# EAGLE schematic control master (EAGLE 8.4.3)
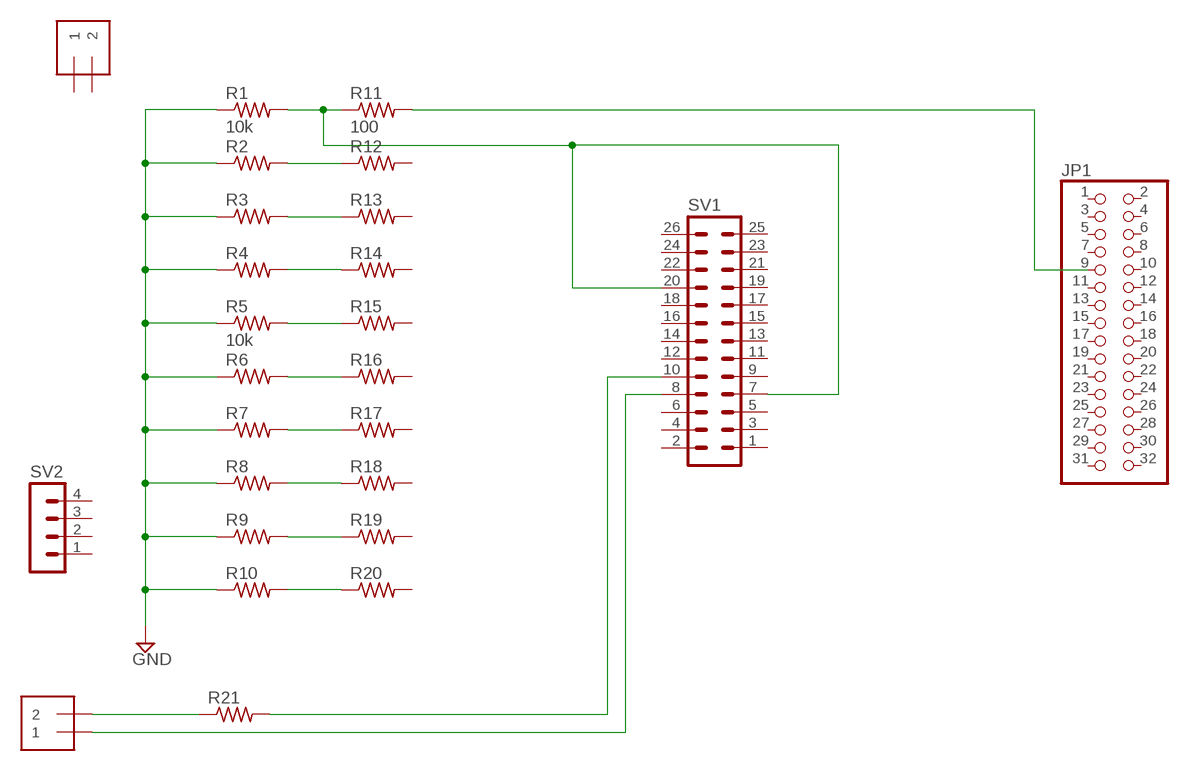
[diagram p0: schematic, sheet 1]

## Parts
J1  1X2-3.5MM  [1X2-3.5MM]
J2  1X2-3.5MM  [1X2-3.5MM]
JP1  PINHD-2X16  [2X16]
R1  10k  R-US_0207/12  [0207/12]
R2  R-US_0207/12  [0207/12]
R3  R-US_0207/12  [0207/12]
R4  R-US_0207/12  [0207/12]
R5  10k  R-US_0207/12  [0207/12]
R6  R-US_0207/12  [0207/12]
R7  R-US_0207/12  [0207/12]
R8  R-US_0207/12  [0207/12]
R9  R-US_0207/12  [0207/12]
R10  R-US_0207/12  [0207/12]
R11  100  R-US_0207/12  [0207/12]
R12  R-US_0207/12  [0207/12]
R13  R-US_0207/12  [0207/12]
R14  R-US_0207/12  [0207/12]
R15  R-US_0207/12  [0207/12]
R16  R-US_0207/12  [0207/12]
R17  R-US_0207/12  [0207/12]
R18  R-US_0207/12  [0207/12]
R19  R-US_0207/12  [0207/12]
R20  R-US_0207/12  [0207/12]
R21  R-US_0207/12  [0207/12]
SV1  MA13-2  [MA13-2]
SV2  MA04-1  [MA04-1]

## Nets
GND: R1.1 R2.1 R3.1 R4.1 R5.1 R6.1 R7.1 R8.1 R9.1 R10.1
N$1: R1.2 R11.1 SV1.7 SV1.20
N$2: R2.2 R12.1
N$3: R3.2 R13.1
N$4: R4.2 R14.1
N$5: R5.2 R15.1
N$6: R6.2 R16.1
N$7: R7.2 R17.1
N$8: R8.2 R18.1
N$9: R9.2 R19.1
N$10: R10.2 R20.1
N$11: JP1.9 R11.2
N$13: J1.2 R21.1
N$14: R21.2 SV1.10
N$15: J1.1 SV1.8
Unconnected: J2.1 J2.2 JP1.1 JP1.2 JP1.3 JP1.4 JP1.5 JP1.6 JP1.7 JP1.8 JP1.10 JP1.11 JP1.12 JP1.13 JP1.14 JP1.15 JP1.16 JP1.17 JP1.18 JP1.19 JP1.20 JP1.21 JP1.22 JP1.23 JP1.24 JP1.25 JP1.26 JP1.27 JP1.28 JP1.29 JP1.30 JP1.31 JP1.32 R12.2 R13.2 R14.2 R15.2 R16.2 R17.2 R18.2 R19.2 R20.2 SV1.1 SV1.2 SV1.3 SV1.4 SV1.5 SV1.6 SV1.9 SV1.11 SV1.12 SV1.13 SV1.14 SV1.15 SV1.16 SV1.17 SV1.18 SV1.19 SV1.21 SV1.22 SV1.23 SV1.24 SV1.25 SV1.26 SV2.1 SV2.2 SV2.3 SV2.4

## Library data of the parts
J1 J2 = adafruit:1X2: 3.5mm Terminal block http://www.ladyada.net/library/pcb/eaglelibrary.html
JP1 = pinhead:PINHD-2X16: PIN HEADER
R1-R21 = adafruit:R-US_: RESISTOR, American symbol
SV1 = con-lstb:MA13-2: PIN HEADER; OC_FARNELL: unknown; OC_NEWARK: unknown
SV2 = con-lstb:MA04-1: PIN HEADER; OC_FARNELL: unknown; OC_NEWARK: unknown